# EAGLE board PushButton_RGB_w_Test (EAGLE 9.6.2)
RELEASE_DATE: 09.01.2023
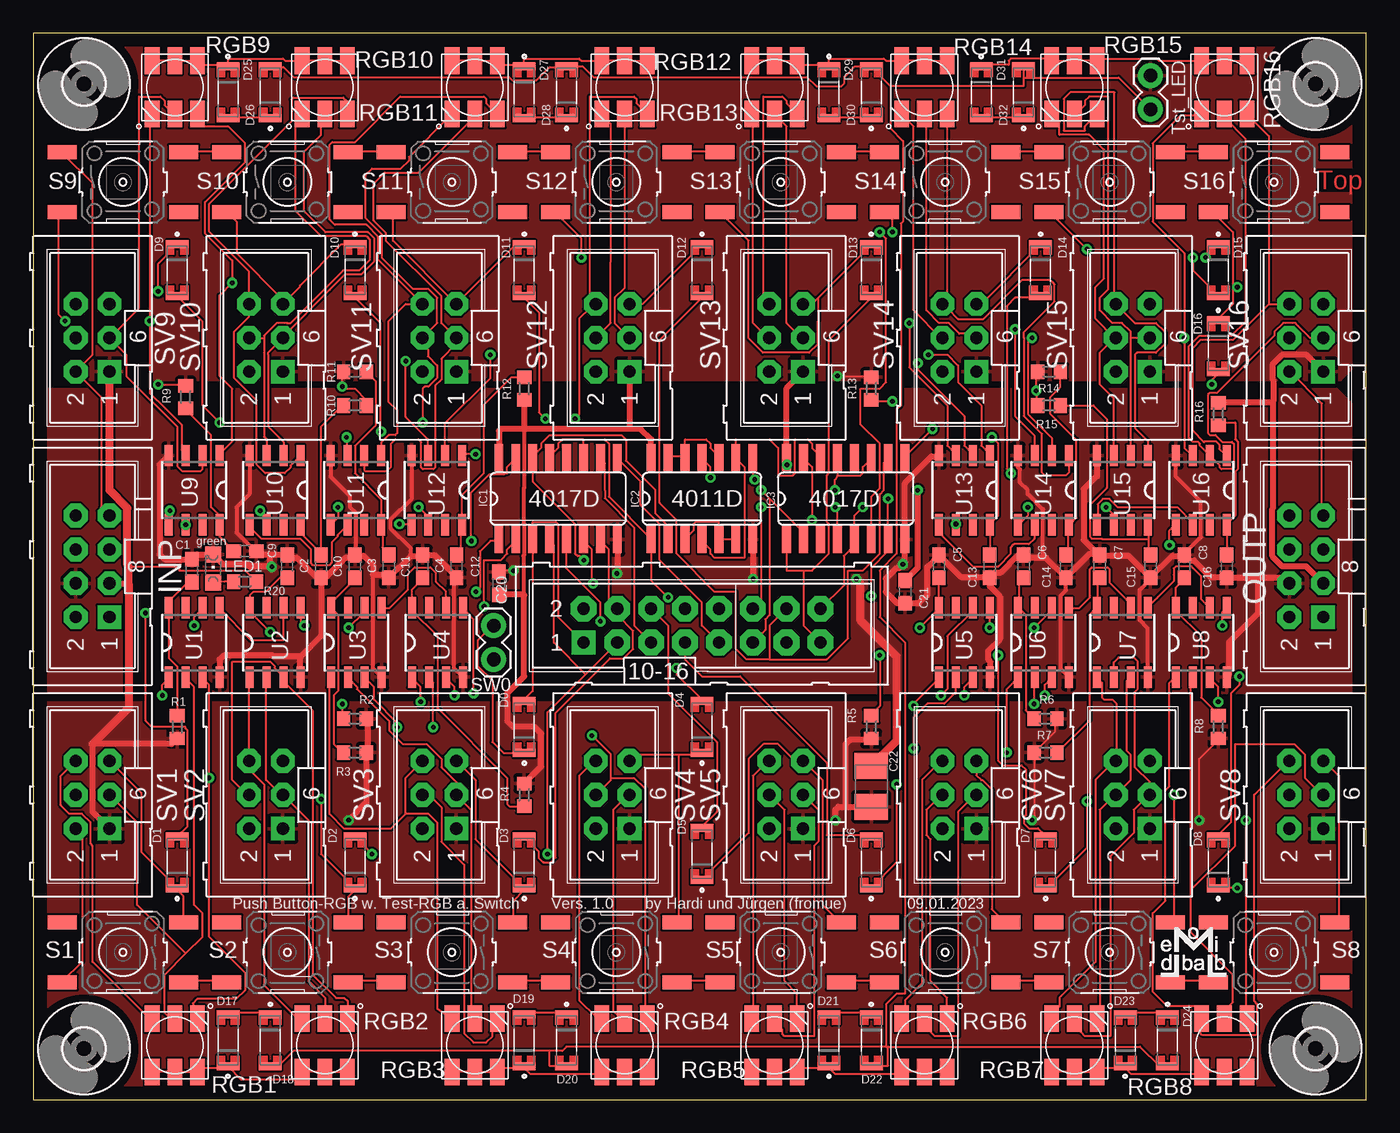
[diagram p1: board, top side]
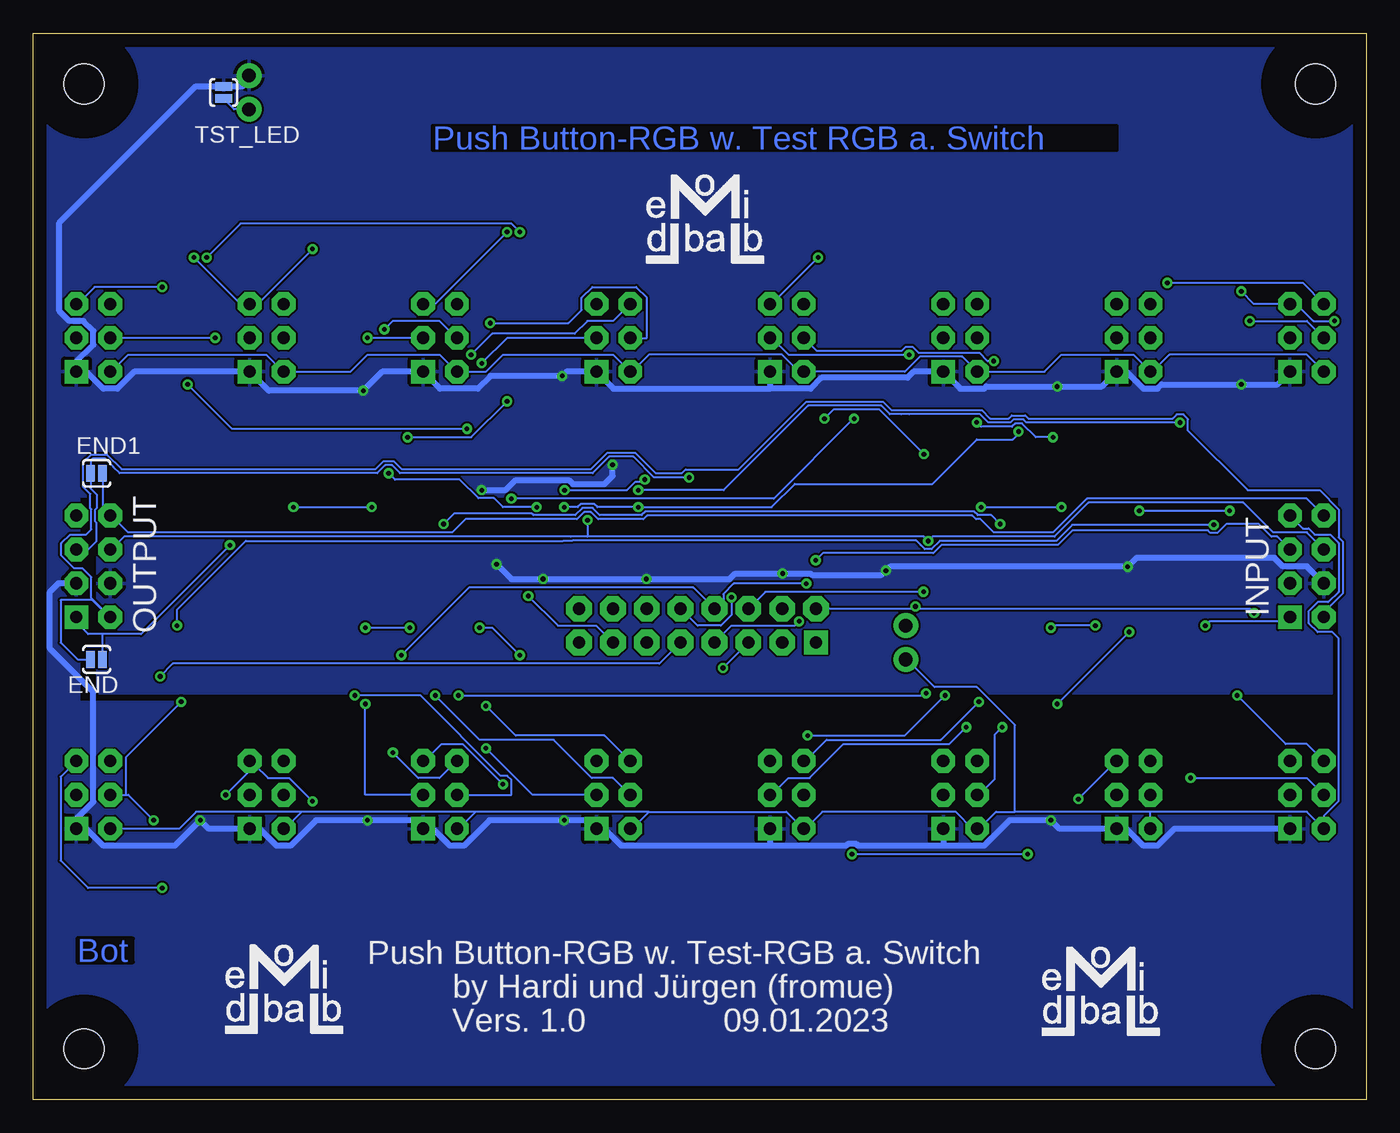
[diagram p2: board, bottom side, seen from below]

Size 100 x 80 mm. Coordinates in mm from the lower left corner, seen from the top.
Outline: 0,0 100,0 100,80 0,80 0,0
Copper layers (1*16): Top 0.035mm / dielectric 1.5mm / Bottom 0.035mm
Design rules "default *": minimum track width 6mil, minimum drill 0.35mm, track to track 6mil, track to pad 6mil, pad to pad 6mil, via to via 6mil, smd to smd 6mil, copper to edge 40mil, drill to drill 6mil, minimum pad ring 10mil, minimum via ring 8mil, stop-mask expansion 4mil, vias tented up to drill 0.35mm, thermal gap 10mil

## Footprints (pad centres in the part's own frame; a part is rotated, then mirrored left to right if it is on the bottom)
CON-HARTING-ML_ML16 = drill 0.914 pad 1.778 square: 1 -8.89,-1.27 | drill 0.914 pad 1.93 octagon: 2 -8.89,1.27; 3 -6.35,-1.27; 4 -6.35,1.27; 5 -3.81,-1.27; 6 -3.81,1.27; 7 -1.27,-1.27; 8 -1.27,1.27; 9 1.27,-1.27; 10 1.27,1.27; 11 3.81,-1.27; 12 3.81,1.27; 13 6.35,-1.27; 14 6.35,1.27; 15 8.89,-1.27; 16 8.89,1.27
C0603 = smd 1.1 x 1: 1 -0.85,0; 2 0.85,0
B/3528-21R = smd 1.95 x 2.5: + 1.525,0; - -1.525,0
DIO_LL4148 = smd 0.6 x 1.65: A 1.95,0; C -1.95,0
SJ_2S-NO = smd 0.635 x 1.27: 1 -0.45,0; 2 0.45,0
3,0 = hole 3: 0,0
SO16 = smd 0.66 x 2.032: 1 -4.445,-3.073; 2 -3.175,-3.073; 3 -1.905,-3.073; 4 -0.635,-3.073; 5 0.635,-3.073; 6 1.905,-3.073; 7 3.175,-3.073; 8 4.445,-3.073; 9 4.445,3.073; 10 3.175,3.073; 11 1.905,3.073; 12 0.635,3.073; 13 -0.635,3.073; 14 -1.905,3.073; 15 -3.175,3.073; 16 -4.445,3.073
SO14 = smd 0.66 x 2.032: 1 -3.81,-3.073; 2 -2.54,-3.073; 3 -1.27,-3.073; 4 0,-3.073; 5 1.27,-3.073; 6 2.54,-3.073; 7 3.81,-3.073; 8 3.81,3.073; 9 2.54,3.073; 10 1.27,3.073; 11 0,3.073; 12 -1.27,3.073; 13 -2.54,3.073; 14 -3.81,3.073
CON-HARTING-ML_ML08 = drill 0.914 pad 1.778 square: 1 -5.08,-1.27 | drill 0.914 pad 1.778 octagon: 2 -5.08,1.27; 3 -2.54,-1.27; 4 -2.54,1.27; 5 0,-1.27; 6 0,1.27; 7 2.54,-1.27; 8 2.54,1.27
CHIPLED_0805 = smd 1.2 x 1.2: A 0,-1.05; C 0,1.05
R0603 = smd 1 x 1.1: 1 -0.85,0; 2 0.85,0
RGBLED5050 = smd 2 x 1.1: 1 -2,1.7; 2 -2,0; 3 -2,-1.7; 4 2,-1.7; 5 2,0; 6 2,1.7
B3F-10XX_SMD = smd 2.184 x 1.067: 1 -4.55,2.25; 2 4.55,2.25; 3 -4.55,-2.25; 4 4.55,-2.25
CON-HARTING-ML_ML6 = drill 0.914 pad 1.778 square: 1 -2.54,-1.27 | drill 0.914 pad 1.778 octagon: 2 -2.54,1.27; 3 0,-1.27; 4 0,1.27; 5 2.54,-1.27; 6 2.54,1.27
1X02 = drill 1.016 pad 1.88: 1 0,0; 2 2.54,0
SOP8 = smd 0.6 x 1.6: 1 -1.905,-2.6; 2 -0.635,-2.6; 3 0.635,-2.6; 4 1.905,-2.6; 5 1.905,2.6; 6 0.635,2.6; 7 -0.635,2.6; 8 -1.905,2.6

## Placement (x,y rotation side)
BUT10_16  [CON-HARTING-ML_ML16]  50.16,35.56 0 top
C1  100n  [C0603]  11.91,39.69 90 top
C2  100n  [C0603]  19.05,40.01 90 top
C3  100n  [C0603]  24.13,40.01 90 top
C4  100n  [C0603]  29.21,40.01 90 top
C5  100n  [C0603]  67.94,40.01 90 top
C6  100n  [C0603]  74.3,40.01 90 top
C7  100n  [C0603]  80.01,40.01 90 top
C8  100n  [C0603]  86.36,40.01 90 top
C9  100n  [C0603]  15.88,41.15 0 top
C10  100n  [C0603]  21.59,40.01 270 top
C11  100n  [C0603]  26.67,40.01 270 top
C12  100n  [C0603]  31.75,40.01 270 top
C13  100n  [C0603]  71.75,40.01 270 top
C14  100n  [C0603]  77.47,40.01 270 top
C15  100n  [C0603]  83.82,40.01 270 top
C16  100n  [C0603]  89.53,40.01 270 top
C20  100n  [C0603]  34.92,38.73 90 top
C21  100n  [C0603]  65.41,38.1 270 top
C22  100uF  [B/3528-21R]  62.87,23.5 270 top
D0  LL4148  [DIO_LL4148]  36.83,27.94 90 top
D1  LL4148  [DIO_LL4148]  10.79,17.78 90 top
D2  LL4148  [DIO_LL4148]  24.13,17.78 90 top
D3  LL4148  [DIO_LL4148]  36.83,17.78 90 top
D4  LL4148  [DIO_LL4148]  50.16,27.94 90 top
D5  LL4148  [DIO_LL4148]  50.16,18.41 90 top
D6  LL4148  [DIO_LL4148]  62.87,17.78 90 top
D7  LL4148  [DIO_LL4148]  75.95,17.78 90 top
D8  LL4148  [DIO_LL4148]  88.9,17.78 90 top
D9  LL4148  [DIO_LL4148]  10.79,62.23 270 top
D10  LL4148  [DIO_LL4148]  24.13,62.23 270 top
D11  LL4148  [DIO_LL4148]  36.83,62.23 270 top
D12  LL4148  [DIO_LL4148]  50.16,62.23 270 top
D13  LL4148  [DIO_LL4148]  62.87,62.23 270 top
D14  LL4148  [DIO_LL4148]  75.56,62.23 270 top
D15  LL4148  [DIO_LL4148]  88.9,62.23 270 top
D16  LL4148  [DIO_LL4148]  88.9,56.52 270 top
D17  LL4148  [DIO_LL4148]  14.61,4.45 90 top
D18  LL4148  [DIO_LL4148]  17.78,4.45 270 top
D19  LL4148  [DIO_LL4148]  36.83,4.45 90 top
D20  LL4148  [DIO_LL4148]  40.01,4.45 270 top
D21  LL4148  [DIO_LL4148]  59.69,4.45 90 top
D22  LL4148  [DIO_LL4148]  62.87,4.45 270 top
D23  LL4148  [DIO_LL4148]  81.92,4.45 90 top
D24  LL4148  [DIO_LL4148]  85.09,4.45 270 top
D25  LL4148  [DIO_LL4148]  14.61,75.56 270 top
D26  LL4148  [DIO_LL4148]  17.78,75.56 90 top
D27  LL4148  [DIO_LL4148]  36.83,75.56 270 top
D28  LL4148  [DIO_LL4148]  40.01,75.56 90 top
D29  LL4148  [DIO_LL4148]  59.69,75.56 270 top
D30  LL4148  [DIO_LL4148]  62.87,75.56 90 top
D31  LL4148  [DIO_LL4148]  71.12,75.56 270 top
D32  LL4148  [DIO_LL4148]  74.3,75.56 90 top
END  SOLDERJUMPERNO  [SJ_2S-NO]  95.25,33.02 0 bottom
END1  SOLDERJUMPERNO  [SJ_2S-NO]  95.25,46.99 0 bottom
H1  MOUNT-HOLE3.0  [3,0]  96.19,3.81 0 top
H2  MOUNT-HOLE3.0  [3,0]  96.19,76.19 0 top
H3  MOUNT-HOLE3.0  [3,0]  3.81,76.19 0 top
H4  MOUNT-HOLE3.0  [3,0]  3.81,3.81 0 top
IC1  4017D  [SO16]  39.37,45.09 0 top
IC2  4011D  [SO14]  50.16,45.09 0 top
IC3  4017D  [SO16]  60.96,45.09 0 top
INP  [CON-HARTING-ML_ML08]  4.45,41.27 90 top
LED1  green  [CHIPLED_0805]  13.49,39.85 0 top
OUTP  [CON-HARTING-ML_ML08]  95.5,41.27 90 top
R1  470  [R0603]  10.79,27.94 270 top
R2  470  [R0603]  24.13,28.57 0 top
R3  470  [R0603]  24.13,26.04 0 top
R4  470  [R0603]  36.83,22.86 90 top
R5  470  [R0603]  62.87,27.94 270 top
R6  470  [R0603]  75.95,28.57 0 top
R7  470  [R0603]  75.95,26.04 180 top
R8  470  [R0603]  88.9,27.94 270 top
R9  470  [R0603]  11.43,52.7 90 top
R10  470  [R0603]  24.13,52.07 0 top
R11  470  [R0603]  24.13,54.61 180 top
R12  470  [R0603]  36.83,53.34 270 top
R13  470  [R0603]  62.87,53.34 90 top
R14  470  [R0603]  76.2,54.61 180 top
R15  470  [R0603]  76.2,52.07 180 top
R16  470  [R0603]  88.9,51.44 90 top
R20  470  [R0603]  15.88,38.86 0 top
RGB1  RGBLED5050  [RGBLED5050]  10.62,4.06 90 top
RGB2  RGBLED5050  [RGBLED5050]  21.86,4.06 90 top
RGB3  RGBLED5050  [RGBLED5050]  33.11,4.06 90 top
RGB4  RGBLED5050  [RGBLED5050]  44.36,4.06 90 top
RGB5  RGBLED5050  [RGBLED5050]  55.61,4.06 90 top
RGB6  RGBLED5050  [RGBLED5050]  66.86,4.06 90 top
RGB7  RGBLED5050  [RGBLED5050]  78.11,4.06 90 top
RGB8  RGBLED5050  [RGBLED5050]  89.36,4.06 90 top
RGB9  RGBLED5050  [RGBLED5050]  10.62,75.95 270 top
RGB10  RGBLED5050  [RGBLED5050]  21.86,75.95 270 top
RGB11  RGBLED5050  [RGBLED5050]  33.11,75.95 270 top
RGB12  RGBLED5050  [RGBLED5050]  44.36,75.95 270 top
RGB13  RGBLED5050  [RGBLED5050]  55.61,75.95 270 top
RGB14  RGBLED5050  [RGBLED5050]  66.86,75.95 270 top
RGB15  RGBLED5050  [RGBLED5050]  78.11,75.95 270 top
RGB16  RGBLED5050  [RGBLED5050]  89.36,75.95 270 top
S1  [B3F-10XX_SMD]  6.73,11.05 180 top
S2  [B3F-10XX_SMD]  19.07,11.05 180 top
S3  [B3F-10XX_SMD]  31.41,11.05 180 top
S4  [B3F-10XX_SMD]  43.74,11.05 180 top
S5  [B3F-10XX_SMD]  56.08,11.05 180 top
S6  [B3F-10XX_SMD]  68.42,11.05 180 top
S7  [B3F-10XX_SMD]  80.75,11.05 180 top
S8  [B3F-10XX_SMD]  93.09,11.05 180 top
S9  [B3F-10XX_SMD]  6.73,68.83 0 top
S10  [B3F-10XX_SMD]  19.07,68.83 0 top
S11  [B3F-10XX_SMD]  31.41,68.83 0 top
S12  [B3F-10XX_SMD]  43.74,68.83 0 top
S13  [B3F-10XX_SMD]  56.08,68.83 0 top
S14  [B3F-10XX_SMD]  68.42,68.83 0 top
S15  [B3F-10XX_SMD]  80.75,68.83 0 top
S16  [B3F-10XX_SMD]  93.09,68.83 0 top
SV1  [CON-HARTING-ML_ML6]  4.45,22.86 90 top
SV2  [CON-HARTING-ML_ML6]  17.45,22.86 90 top
SV3  [CON-HARTING-ML_ML6]  30.46,22.86 90 top
SV4  [CON-HARTING-ML_ML6]  43.47,22.86 90 top
SV5  [CON-HARTING-ML_ML6]  56.48,22.86 90 top
SV6  [CON-HARTING-ML_ML6]  69.48,22.86 90 top
SV7  [CON-HARTING-ML_ML6]  82.49,22.86 90 top
SV8  [CON-HARTING-ML_ML6]  95.5,22.86 90 top
SV9  [CON-HARTING-ML_ML6]  4.45,57.15 90 top
SV10  [CON-HARTING-ML_ML6]  17.45,57.15 90 top
SV11  [CON-HARTING-ML_ML6]  30.46,57.15 90 top
SV12  [CON-HARTING-ML_ML6]  43.47,57.15 90 top
SV13  [CON-HARTING-ML_ML6]  56.48,57.15 90 top
SV14  [CON-HARTING-ML_ML6]  69.48,57.15 90 top
SV15  [CON-HARTING-ML_ML6]  82.49,57.15 90 top
SV16  [CON-HARTING-ML_ML6]  95.5,57.15 90 top
SW0  [1X02]  34.54,33.02 90 top
TST_LED  SOLDERJUMPERNO  [SJ_2S-NO]  85.72,75.56 270 bottom
TST_LED1  Tst_LED  [1X02]  83.82,74.3 90 top
U1  [SOP8]  12.06,34.29 0 top
U2  [SOP8]  18.15,34.29 0 top
U3  [SOP8]  24.24,34.29 0 top
U4  [SOP8]  30.32,34.29 0 top
U5  [SOP8]  69.85,34.29 0 top
U6  [SOP8]  75.78,34.29 0 top
U7  [SOP8]  81.7,34.29 0 top
U8  [SOP8]  87.63,34.29 0 top
U9  [SOP8]  12.06,45.72 180 top
U10  [SOP8]  18.13,45.72 180 top
U11  [SOP8]  24.2,45.72 180 top
U12  [SOP8]  30.27,45.72 180 top
U13  [SOP8]  69.85,45.72 180 top
U14  [SOP8]  75.78,45.72 180 top
U15  [SOP8]  81.7,45.72 180 top
U16  [SOP8]  87.63,45.72 180 top

## Tracks (layer width: path | path; a pad name or v marks a point on that pad's centre or on a via)
+5V  (via drill 0.35)
  Top 0.152: R6.2 76.68,28.57 76.68,27.61 R7.2 75.1,20.96 75.09,20.95 v74.93,20.95 | v87.47,20.95 87.47,25.56 88.9,26.99 R8.2 | 25.08,26.04 R3.2 | 7.14,40.01 10.79,40.01 10.95,39.85 10.95,39.69 15.88,39.69 16.67,38.89 R20.2 | v9.37,53.66 11.43,53.66 R9.2 | R11.2 23.34,54.61 23.18,54.45 v23.18,53.5 23.34,53.34 24.13,53.34 24.98,52.49 R10.2 | v60.33,54.29 62.87,54.29 R13.2 | R15.2 75.25,52.07 v75.25,53.18 75.25,54.51 R14.2
  Top 0.305: 36.83,50.32 36.83,45.89 36.78,45.84 36.78,43.2 36.83,43.15 36.83,40.87 36.77,40.81 36.77,37.88
  Top 0.457: IC1.16 34.92,50.16 35.08,50.32 36.83,50.32 | IC2.14 46.35,49.54 45.57,50.32 44.77,50.32 | R12.2 36.83,50.32 | R2.2 25.08,28.47 25.08,26.04 | R3.2 24.98,22.28 v23.65,20.95 | R4.2 38.1,24.98 38.1,27.46 37.62,27.94 36.04,27.94 35.56,28.42 35.56,30.48 36.83,31.75 36.83,37.83 36.77,37.88 C20.1 | v60.17,20.95 60.17,21.75 60.39,21.97 60.96,21.97 | 60.96,21.97 C22.+ | 60.96,21.97 60.96,26.67 61.28,26.99 62.76,26.99 R5.2 | C21.1 66.36,39.9 v66.36,45.72 | SV13.1 56.52,53.38 IC3.16 56.54,48.13 v56.54,47.62 | INP.3 7.14,38.73 | SV1.1 4.45,21.59 4.45,26.67 10.38,26.67 R1.2 | 93.03,52.39 93.03,44.41 92.96,44.34 92.96,40.75 93.7,40.01 95.5,40.01 OUTP.3 | 93.03,52.39 92.92,52.28 R16.2 | SV16.1 95.5,55.88 93.7,55.88 92.96,55.14 92.96,54.08 93.03,54.02 93.03,52.39 | 44.77,50.32 36.83,50.32 | 44.77,50.32 44.74,50.35 SV12.1
  Top 0.61: 4.45,26.67 7.14,29.37 7.14,38.73 7.14,40.01 7.06,40.09 7.06,44.37 5.71,45.72 SV9.1
  Bottom 0.152: 83.66,20.32 SV7.1 | 96.68,20.32 SV8.1
  Bottom 0.457: SV1.1 14.39,20.32 15.66,19.05 16.71,19.05 17.98,20.32 SV2.1 23.02,20.32 v23.65,20.95 26.76,20.95 28.66,19.05 31.73,19.05 | 31.73,19.05 38.14,19.05 38.26,19.17 38.89,19.17 39.02,19.05 44.61,19.05 | SV3.1 31.73,19.05 | 44.61,19.05 55.88,19.05 57.15,20.32 SV5.1 58.38,20.95 v60.17,20.95 65.78,20.95 67.69,19.05 68.74,19.05 70.01,20.32 SV6.1 71.39,20.95 v74.93,20.95 78.79,20.95 80.7,19.05 81.75,19.05 83.02,20.32 83.66,20.32 | SV4.1 44.74,19.18 44.61,19.05 | v66.36,45.72 64.57,45.72 63.81,46.48 59.82,46.48 59.52,46.18 57.15,46.18 56.54,46.78 v56.54,47.62 | 44.77,53.34 56.48,53.34 SV13.1 60.01,54.61 v60.33,54.29 65.71,54.29 66.66,53.34 69.48,53.34 SV14.1 73.82,54.61 v75.25,53.18 82.33,53.18 SV15.1 92.43,54.61 93.7,53.34 94.76,53.34 96.03,54.61 SV16.1 96.77,55.35 95.5,56.62 95.5,57.68 96.24,58.42 97.3,58.42 98.04,59.16 98.04,65.79 87.81,76.02 TST_LED.1 84.32,76.02 83.82,76.52 TST_LED1.2 | SV9.1 6.67,53.66 v9.37,53.66 15.34,53.66 15.66,53.34 16.71,53.34 17.98,54.61 SV10.1 19.83,53.5 v23.18,53.5 28.51,53.5 28.66,53.34 30.46,53.34 SV11.1 33.96,54.61 34.42,54.15 40.86,54.15 41.67,53.34 44.77,53.34 | 44.77,53.34 | SV12.1 44.74,53.37 44.77,53.34 | SV7.1 86.84,20.32 v87.47,20.95 89.38,19.05 94.76,19.05 96.03,20.32 96.68,20.32 | SV8.1 96.77,21.06 95.5,22.33 95.5,30.57 98.75,33.83 98.75,38.1 98.12,38.73 OUTP.3
  pour Top: 0.16,53.98 98.11,53.98 100.01,55.88 100.01,79.06 99.06,80.01 2.54,80.01 0,77.47 0,54.13
  pour Top: 99.06,29.84 99.38,29.84 100.01,29.21 100.01,0.95 99.06,0 1.27,0 0,1.27 0,2.54 0,29.21 0.64,29.84 3.81,29.84
  pour Bottom: 0,29.84 99.69,29.84 101.6,27.94 101.6,1.27 100.33,0 91.44,0 0,0 -1.27,1.27 -1.27,29.21 -0.64,29.84
  pour Bottom: 0,45.24 98.58,45.24 100.33,46.99 100.33,78.74 99.06,80.01 2.54,80.01 0,77.47
  pour Bottom: 95.89,45.24 95.89,45.09 95.73,45.24 2.06,45.24 2.06,30 2.22,29.84 96.52,29.84 96.52,45.09 100.33,45.09 100.33,2.54 97.79,0 1.27,0 0,1.27 0,77.47 2.54,80.01 99.06,80.01 100.33,78.74 100.33,45.72 99.85,45.24
BUTTONS
  Top 0.152: SV1.2 3.65,19.84 3.65,10.32 2.22,8.89 S1.2 | S9.1 2.22,70.96 4.45,68.74 4.45,55.88 SV9.2 5.08,52.7 5.08,44.45 INP.7 | SV16.2 94.3,54.61 96.68,52.23 96.68,43.81 OUTP.7
  Bottom 0.152: 53.82,21.59 43.5,21.59 42.23,20.32 SV4.2 42.07,20.32 40.8,21.59 30.8,21.59 29.53,20.32 SV3.2 29.05,20.32 27.78,21.59 26.35,21.59 | 53.82,21.59 55.09,20.32 SV5.2 | 66.83,21.59 68.1,20.32 SV6.2 | 53.82,21.59 66.83,21.59 | 79.85,21.59 81.12,20.32 SV7.2 | 66.83,21.59 79.85,21.59 | SV8.2 89.06,20.32 87.79,21.59 79.85,21.59 | 26.35,21.59 26.35,28.1 29.21,30.96 32.38,30.96 34.45,33.02 SW0.1 | SV9.2 4.45,55.88 14.76,55.88 16.03,54.61 SV10.2 16.19,54.61 17.46,55.88 22.86,55.88 24.13,54.61 SV11.2 30.31,55.73 33.49,55.73 34.61,54.61 SV12.2 42.55,54.61 43.81,55.88 53.82,55.88 55.09,54.61 SV13.2 55.24,54.61 56.52,55.88 64.77,55.88 66.04,54.61 SV14.2 68.26,54.61 69.53,55.88 74.93,55.88 76.2,54.61 SV15.2 81.28,54.61 82.55,55.88 92.87,55.88 94.14,54.61 SV16.2 | INP.7 4.75,42.85 4.32,42.85 3.86,42.39 2.71,42.39 2.06,41.74 2.06,38.1 2.85,37.31 3.64,37.31 4.29,36.66 4.29,35.73 3.64,35.08 2.53,35.08 2.06,34.6 2.06,22.4 3.17,21.28 SV1.2 4.45,21.59 16.18,21.59 | SV2.2 16.18,21.59 | 16.18,21.59 26.35,21.59
CLK_IN  (via drill 0.35)
  Top 0.152: IC2.2 47.62,43.02 46.67,43.97 46.67,45.72 44.45,47.94 44.45,49.53 44.13,49.85 38.73,49.85 38.1,49.21 38.1,48.9 37.47,48.26 IC1.14 37.47,46.35 40.64,43.18 40.64,40.98 40.85,40.77 41,40.77 v41.3,40.47
  Bottom 0.152: v41.3,40.47 40.77,41 32.48,41 31.86,41.62 23.13,41.62 22.04,42.7 11.87,42.7 11.68,42.51 11.18,42.51 10.51,43.18 8.05,43.18 7.11,42.24 6.68,42.24 INP.5
CLK_NEXT_CHAIN
  Bottom 0.152: END1.2 94.77,46.99 94.77,43.81 OUTP.8 94.14,43.81 92.87,42.55 68.58,42.55 67.59,43.54 59.21,43.54 58.67,44.08 58.17,44.08 57.63,43.54 54.23,43.54 53.96,43.81 29.55,43.81 29.27,43.54 28.93,43.54 27.94,42.55 23.5,42.55 20.95,45.09 4.45,45.09 INP.8
CLK_OUT  (via drill 0.35)
  Top 0.152: v50.8,46.67 50.8,47.47 50.16,48.1 IC2.11
  Bottom 0.152: v50.8,46.67 53.42,46.67 54.98,48.23 56.8,48.23 58.04,46.99 72.48,46.99 73.09,47.6 73.59,47.6 74.2,46.99 93.52,46.99 93.99,47.46 93.99,47.48 94.61,48.1 95.54,48.1 95.7,47.94 END1.1 95.7,45.85 95.25,45.4 95.25,44.38 95.35,44.28 95.35,43.35 95.25,43.25 95.25,41.91 95.89,41.27 OUTP.5
DIN  (via drill 0.35)
  Top 0.152: v12.06,35.56 12.06,36.2 12.7,36.83 U1.6
  Bottom 0.152: v12.06,35.56 11.75,35.88 6.03,35.88 INP.1
GND  (via drill 0.35)
  Top 0.152: 71.75,39.21 C13.2 | 80.01,40.96 C7.2 80.01,40.8 | 77.47,39.05 C14.2 | 89.53,39.21 C16.2 | 86.36,40.8 C8.2 | 83.82,39.05 C15.2 | 94.14,38.73 OUTP.4 | 29.21,40.8 C4.2 | 20,33.02 20,33.18 | 21.59,39.21 C10.2 | v36.04,39.69 34.92,39.69 C20.2 | 16.67,41.12 C9.2
  Top 0.305: 77.47,39.05 77.47,38.21 77.08,37.82 77.08,32.3 U6.4 | U7.4 83.61,35.36 83,35.96 83,38.24 83.82,39.05 | 75.98,40.64 75.75,40.88 75.75,44.28 74.61,45.42 74.61,45.72 74.03,46.31 74.03,47.27 73.87,47.43 U14.4 | C8.2 86.36,40.95 87.6,42.19 87.6,44.86 85.72,46.73 U16.4 | U4.4 31.56,32.35 31.56,38.97 C12.2 | U3.4 25.48,32.35 25.48,39.37 | 28.31,40.8 28.31,41.36 26.78,42.9 26.78,43.46 28.36,45.05 U12.4 | U11.4 22.3,46.76 23.75,45.31 23.75,44.47 24.17,44.05 24.17,41.16 24.13,41.12 C3.2 | U10.4 16.23,45.44 15.24,44.45 15.24,42.55 16.67,41.12
  Top 0.457: 71.75,39.21 69.59,39.21 C5.2 67.06,39.97 67.06,37.85 66.46,37.25 C21.2 64.81,37.25 63.96,38.1 63.96,39.09 64.75,39.88 64.96,39.88 v65.25,40.16 65.41,40.32 IC3.8 65.41,46.27 67.39,48.26 67.94,48.26 U13.4 | 80.01,40.96 79.27,40.96 C14.2 75.98,40.64 74.51,40.64 C6.2 73.89,40.85 72.58,39.55 72.15,39.55 C13.2 71.75,38.53 72.51,37.77 72.51,34.53 71.63,33.65 71.63,33.02 71.75,32.9 U5.4 | 86.36,40.8 85.46,40.8 C15.2 82.18,40.8 80.01,40.8 78.81,42 78.81,45.79 79.8,46.78 U15.4 | C8.2 86.75,40.46 87.07,40.46 88.32,39.21 89.53,39.21 | C16.2 91.92,39.16 | 91.92,39.16 93.72,39.16 94.14,38.73 | U8.4 89.73,31.88 89.73,34.33 91.92,36.51 91.92,39.16 | IC1.8 43.81,39.49 v43.79,39.47 | IC2.7 54,41.98 v54,39.05 | C12.2 31.69,39.21 31.69,39.27 30.11,40.85 C4.2 | U9.4 9.48,47.64 9.48,40.9 9.84,40.54 C1.2 12.27,40.9 LED1.C 14.24,40.15 16.06,40.15 16.23,39.98 v17.89,39.98 17.78,40.09 17.78,40.85 | 29.21,40.8 28.31,40.8 C11.2 26.45,39.37 25.48,39.37 25.48,40.09 24.77,40.8 24.19,40.8 C3.2 23.91,40.64 23.39,40.64 21.97,39.21 21.59,39.21 21.21,39.21 19.79,40.64 19.27,40.64 C2.2 17.78,40.85 | 17.78,40.85 17.02,40.85 C9.2 | C10.2 21.59,34.77 20.08,33.26 | 20.08,33.26 20,33.18 | U2.4 20,31.74 20,33.02 | 20.08,33.26 18.03,33.26 17.97,33.32 14.27,33.32 13.97,33.02 U1.4
  Top 0.61: C22.- 64.77,26.93 64.77,33.25 62.03,35.99 62.03,38.78 v61.75,39.05
  Bottom 0.457: INP.4 4.45,40.01 6.24,40.01 6.88,40.64 17.23,40.64 v17.89,39.98 35.75,39.98 v36.04,39.69 36.35,39.37 41.59,39.37 41.69,39.47 v43.79,39.47 47.34,39.47 47.75,39.05 v54,39.05 v61.75,39.05 64.14,39.05 v65.25,40.16
  pour Top: 0,53.34 97.79,53.34 100.33,50.8 100.33,31.75 99.06,30.48 1.27,30.48 0,31.75
  pour Bottom: 2.54,44.45 95.25,44.45 95.25,30.48 2.54,30.48
N$1
  Top 0.152: 51.44,42.07 51.44,43.34 49.69,43.34 49.53,43.18 49.53,42.7 48.9,42.07 IC2.3 | 51.44,42.07 52.7,42.07 IC2.6 | 51.44,42.07 IC2.5
N$2
  Top 0.152: U11.6 23.5,43.02 22.82,42.35 22.82,42.23 22.38,41.78 22.38,40.27 22.18,40.08 21,40.08 20.8,40.27 20.8,41.32 20.02,42.09 17.1,42.09 16.34,42.86 16.34,43.01 U10.5
N$3  (via drill 0.35)
  Top 0.152: 55.24,45.09 57.78,42.55 IC3.2 | 55.24,45.09 v54.61,45.72 | BUT10_16.11 54.93,35.24 54.93,36.04 55.24,36.35 55.24,45.09 | D9.A 12.7,58.38 12.7,52.07 v13.97,50.8
  Bottom 0.152: v54.61,45.72 48.22,45.72 43.16,50.78 41.88,52.06 36.39,52.06 35.74,51.41 34.9,51.41 34.29,51.41 28.96,51.41 28.35,50.8 26.69,50.8 26.46,51.03 25.7,51.03 25.48,50.8 v13.97,50.8
N$4
  Top 0.152: U1.5 13.97,36.83 16.35,34.45 18.73,34.45 18.73,36.83 U2.6
N$5  (via drill 0.35)
  Top 0.152: 41.27,49.53 39.69,49.53 39.37,49.21 39.37,48.9 38.73,48.26 IC1.13 | IC1.11 41.27,49.53 | 41.27,49.53 42.86,49.53 43.18,49.21 43.18,45.24 46.35,42.07 IC2.1 46.35,38.95 v47.62,37.67
  Bottom 0.152: BUT10_16.10 50.16,35.56 48.42,35.56 47.62,36.35 v47.62,37.67
N$6  (via drill 0.35)
  Top 0.152: v23.18,29.69 23.18,28.57 R2.1 | v17.78,35.08 16.35,36.51 16.35,36.83 U2.8 16.25,37.82 16.51,38.08 17.44,38.08 18.51,39.16 C2.1
  Bottom 0.152: v17.78,35.08 v23.18,29.69
N$7
  Top 0.152: SW0.2 34.45,35.56 33.34,34.45 33.34,32.54 34.45,31.43 34.45,26.83 35.29,25.99 D0.C
N$8
  Top 0.152: SV2.4 16.03,22.86 14.92,23.97 14.92,32.86 17.78,32.86 18.1,32.54 18.1,32.38 18.73,31.75 U2.3 18.89,31.59 18.89,31.27 20.95,29.21 20.95,9.37 22.7,7.62 23.34,7.62 23.57,7.39 RGB2.4
N$9
  Top 0.152: 16.19,25.4 16.19,31.59 U2.1 | 16.19,25.4 16.19,24.77 17.3,23.65 17.3,8.57 19.68,6.19 RGB2.6 | 16.19,25.4 SV2.6
N$10
  Top 0.152: U2.2 17.46,31.59 17.46,23.97 18.57,22.86 SV2.3 18.73,22.86 20.64,20.95 20.64,8.89 21.91,7.62 21.91,6.11 RGB2.5
N$11  (via drill 0.35)
  Top 0.152: v33.81,36.99 33.81,40.48 35.08,40.48 35.56,40.96 35.56,41.27 36.2,41.91 IC1.2 | v8.41,36.51 8.41,28.42 8.89,27.94 11.43,27.94 11.43,27.83 11.57,27.68 11.57,20.51 D1.A
  Bottom 0.152: v8.41,36.51 8.73,36.83 33.81,36.83 | BUT10_16.2 33.81,36.83 | 33.81,36.83 v33.81,36.99
N$12  (via drill 0.35)
  Top 0.152: v25.4,18.41 24.13,19.68 D2.A | BUT10_16.3 41.43,31.91 | 41.43,31.91 39.05,34.29 39.05,41.59 38.73,41.91 IC1.4 | v38.58,18.41 38.58,29.05 41.43,31.91
  Bottom 0.152: v38.58,18.41 v25.4,18.41
N$13
  Top 0.152: D3.A 36.83,19.68 37.94,18.57 37.94,18.1 38.26,17.78 38.29,17.81 38.83,17.81 39.18,18.16 39.18,29.02 43.26,33.1 44.31,33.1 44.37,33.1 44.37,33.16 45.01,33.8 45.01,35.16 43.81,36.35 BUT10_16.4 43.18,37.47 43.18,41.27 42.55,41.91 IC1.7
N$14  (via drill 0.35)
  Top 0.152: v48.26,32.38 48.26,31.91 50.16,30 D4.A | BUT10_16.5 45.09,35.56 45.09,36.83 | IC1.10 42.55,48.1 42.86,47.78 42.86,45.72 42.88,45.71 42.88,45.12 45.09,42.91 45.09,36.83 | 45.09,36.83
  Bottom 0.152: BUT10_16.5 v48.26,32.38
N$15  (via drill 0.35)
  Top 0.152: BUT10_16.6 47.62,35.56 47.62,30.48 51.28,26.83 51.28,21.59 50.16,20.48 D5.A | IC1.1 34.92,41.91 34.29,41.91 33.51,41.13 33.51,38.4 v33.21,38.1
  Bottom 0.152: BUT10_16.6 45.09,38.1 v33.21,38.1
N$16  (via drill 0.35)
  Top 0.152: BUT10_16.7 48.9,33.02 50.16,31.75 53.02,31.75 59.53,25.24 59.53,19.84 62.87,19.84 D6.A | v42.55,35.88 42.55,37.31 40.01,39.85 IC1.5
  Bottom 0.152: v42.55,35.88 42.86,35.56 47.62,35.56 BUT10_16.7
N$17  (via drill 0.35)
  Top 0.152: v72.39,33.34 72.39,33.02 72.42,32.99 72.42,25.4 72.74,25.08 74.14,25.08 74.45,24.77 74.45,21.34 74.32,21.21 74.32,20.7 74.68,20.35 75.38,20.35 75.88,19.84 D7.A | IC1.6 41.27,41.91 41.91,41.27 41.91,38.8 v42,38.71
  Bottom 0.152: v72.39,33.34 67.31,38.42 50.48,38.42 BUT10_16.8 48.23,37.49 48.23,37.93 47.45,38.71 v42,38.71
N$18  (via drill 0.35)
  Top 0.152: v90.49,31.75 90.49,31.11 89.85,30.48 89.85,20.8 88.9,19.84 D8.A | BUT10_16.9 50.16,35.56 50.16,37.31 46.99,40.48 46.99,43.18 45.56,44.61 45.56,46.35 43.81,48.1 IC1.9
  Bottom 0.152: v90.49,31.75 89.53,32.7 53.02,32.7 BUT10_16.9
N$19
  Top 0.152: 11.43,10.95 9.84,9.37 9.84,6.51 10.16,6.19 RGB1.5 | 11.43,10.95 12.7,12.22 12.7,13.97 12.06,14.61 12.06,30.96 11.43,31.59 U1.2 | SV1.3 7.78,20.8 7.78,14.61 11.43,10.95
N$20
  Top 0.152: 63.98,3.97 40.01,3.97 39.69,3.65 38.73,3.65 | 63.98,3.97 64.14,3.97 | 64.14,3.97 83.03,3.97 84.5,2.5 D24.A | D26.A 17.78,77.47 18.77,77.47 19.52,76.72 35.68,76.72 35.91,76.49 37.75,76.49 38.73,77.47 40.01,77.47 D28.A 41.22,77.52 42.02,76.72 58.06,76.72 58.74,76.04 60.64,76.04 60.84,76.24 60.84,76.72 61.64,77.52 D30.A 62.87,77.47 64.29,76.04 | 64.29,76.04 74.3,76.04 74.3,76.68 | D32.A 74.3,76.68 | TST_LED1.1 81.44,76.68 74.3,76.68 | 63.98,3.97 63.98,7.14 64.77,7.94 65.41,7.94 65.41,34.29 63.5,36.2 63.5,39.69 64.77,40.96 64.77,51.75 65.09,52.07 65.09,65.72 65.25,65.88 65.25,71.91 64.29,72.87 64.29,76.04 | D18.A 17.19,2.54 18.41,2.54 19.53,3.65 38.73,3.65 | D22.A 62.91,2.54 64.14,2.54 64.14,3.97 | D20.A 38.78,2.5 38.73,2.54 38.73,3.65
  Bottom 0.152: TST_LED1.1 84.93,74.3 85.72,75.09 TST_LED.2
N$21
  Top 0.152: R20.1 14.35,38.86 LED1.A
N$22
  Top 0.152: D17.A 14.76,6.51 16.99,6.51 D18.C
N$23
  Top 0.152: S1.1 11.43,8.89 14.45,8.89 S2.2
N$24  (via drill 0.35)
  Top 0.152: v23.65,35.4 24.77,36.51 24.77,36.83 U3.6 | U2.5 20.05,35.67 20.16,35.56 v20.32,35.56
  Bottom 0.152: v20.32,35.56 23.5,35.56 v23.65,35.4
N$25
  Top 0.152: S10.3 14.61,66.52 15.24,65.88 15.24,63.5 18.72,60.02 SV10.5 20.02,60.98 20.02,61.09 23.11,64.18 D10.C
N$26  (via drill 0.35)
  Top 0.152: U1.3 12.7,31.59 13.18,31.11 v13.18,24.13 13.18,12.22 15.88,9.53 15.88,8.21 15.21,7.54 12.3,7.54 11.99,7.22 RGB1.4
  Bottom 0.152: SV1.4 4.45,24.13 v13.18,24.13
N$27  (via drill 0.35)
  Top 0.152: v9.68,30.32 9.68,31.11 10.16,31.59 U1.1 | RGB1.6 8.57,6.19 4.45,10.32 4.45,19.05 4.29,19.2 4.29,20.78 3.64,21.44 2.69,21.44 2.06,22.07 2.06,24.28 SV1.6
  Bottom 0.152: v9.68,30.32 6.03,26.67 4.45,26.67 SV1.6
N$28  (via drill 0.35)
  Top 0.152: v60.17,44.45 60.33,44.29 IC3.4 | D10.A 24.13,60.17 26.01,58.28 26.01,50.19 v26.08,50.12 | BUT10_16.12 54.61,37.47 v54.61,44.45
  Bottom 0.152: v26.08,50.12 26.04,50.07 26.04,50.01 26.51,49.53 29.21,49.53 32.54,46.2 42.86,46.2 44.61,44.45 v54.61,44.45 57.68,44.45 57.92,44.69 58.92,44.69 59.16,44.45 v60.17,44.45
N$29  (via drill 0.35)
  Top 0.152: v64.14,45.09 IC3.7 64.14,41.16 62.87,39.89 v62.87,37.78 | D11.A 36.83,60.17 37.94,59.05 37.94,51.56 v38.42,51.08
  Bottom 0.152: BUT10_16.13 57.78,35.56 60.64,35.56 v62.87,37.78 | v38.42,51.08 38.45,51.08 44.45,45.09 v64.14,45.09
N$30
  Top 0.152: 55.24,33.02 53.5,33.02 52.7,33.81 52.7,38.1 51.12,38.1 48.26,40.96 48.26,43.5 46.99,44.77 46.99,56.99 50.16,60.17 D12.A | 55.24,33.02 55.24,35.56 BUT10_16.14 | 55.24,33.02 59.53,33.02 61.12,34.61 61.12,39.69 62.23,39.69 63.5,40.96 63.5,45.4 63.82,45.72 63.82,47.78 64.14,48.1 IC3.10
N$31
  Top 0.152: 57.78,39.69 56.52,39.69 IC3.1 | 57.78,39.69 58.42,39.69 59.69,40.96 59.69,43.18 59.53,43.34 59.53,46.83 59.69,46.99 59.69,56.99 62.87,60.17 D13.A | BUT10_16.15 57.78,35.56 57.78,39.69
N$32
  Top 0.152: S2.1 23.65,8.89 26.83,8.89 S3.2
N$33  (via drill 0.35)
  Top 0.152: v73.34,46.99 73.03,47.31 73.03,59.53 73.66,60.17 75.56,60.17 D14.A | v62.23,44.45 61.59,43.81 IC3.5 61.59,41.59 60.8,40.8 60.8,38.58 BUT10_16.16
  Bottom 0.152: v62.23,44.45 64.77,44.45 65.43,45.11 66.61,45.11 68.01,46.51 72.87,46.51 v73.34,46.99
N$34
  Top 0.152: S3.1 36.04,8.89 39.05,8.89 S4.2
N$35
  Top 0.152: D0.A 36.83,30 37.47,30.64 IC1.3 37.47,43.34 39.21,43.34 39.37,43.18 39.37,36.2 BUT10_16.1
N$36  (via drill 0.35)
  Top 0.152: v87,63.18 87,62.23 88.9,60.33 D15.A | v63.5,65.09 63.98,64.61 63.98,53.82 63.5,53.34 62.07,53.34 62.07,50.64 63.5,49.21 63.5,45.88 62.87,45.24 IC3.6
  Bottom 0.152: v87,63.18 84.45,65.72 64.14,65.72 v63.5,65.09
N$37  (via drill 0.35)
  Top 0.152: v88.42,53.66 88.42,53.98 88.9,54.45 D16.A | v67.47,50.32 65.41,48.26 IC3.9
  Bottom 0.152: v88.42,53.66 85.09,50.32 v67.47,50.32
N$38
  Top 0.152: 48.9,48.26 47.62,48.26 IC2.13 | 48.9,48.26 48.9,49.53 50.48,49.53 50.8,49.21 50.8,48.9 51.44,48.26 IC2.10 | 48.9,48.26 IC2.12
N$39
  Top 0.152: D19.A 36.83,6.51 39.37,6.51 D20.C
N$40  (via drill 0.35)
  Top 0.152: IC3.13 60.33,46.83 | 60.33,46.83 62.07,46.83 62.23,46.99 62.23,47.47 62.87,48.1 IC3.11 | 60.33,46.83 60.17,46.51 60.14,46.49 v60.14,45.72 | IC2.8 53.98,46.67 v54.13,46.52
  Bottom 0.152: v60.14,45.72 55.47,45.72 54.86,46.33 54.32,46.33 v54.13,46.52
N$41
  Top 0.152: IC2.4 50.16,41.91 50.8,41.27 50.8,40.96 51.12,40.64 53.34,40.64 53.34,47.47 52.7,48.1 IC2.9 52.7,49.53 55.24,49.53 55.88,48.9 55.88,46.83 56.99,46.83 57.15,46.99 57.15,49.53 58.1,49.53 58.42,49.21 58.42,48.9 59.05,48.26 IC3.14
N$42
  Top 0.152: S4.1 48.42,8.89 51.44,8.89 S5.2
N$43
  Top 0.152: D21.A 59.69,6.51 62.23,6.51 D22.C
N$44
  Top 0.152: S5.1 60.64,8.89 63.82,8.89 S6.2
N$45
  Top 0.152: R3.1 23.18,26.04 22.54,26.67 22.54,30.32 22.86,30.64 22.86,36.35 22.38,36.83 U3.8 22.38,36.99 22.38,37.31 24.13,39.05 C3.1
N$46
  Top 0.152: S3.3 36.04,13.34 36.04,14.92 36.83,15.72 D3.C 36.83,15.88 33.18,19.53 33.18,23.97 31.75,25.4 SV3.5
N$47  (via drill 0.35)
  Top 0.152: v27.3,27.94 27.3,28.26 25.56,30 25.56,30.96 24.92,31.59 U3.3 | RGB3.4 34.45,6.03 34.45,4.76 33.97,4.29 33.02,4.29 32.34,4.97 32.34,17.61 30.61,19.34 30.61,21.93 29.69,22.86 SV3.4
  Bottom 0.152: SV3.4 29.05,22.86 27.86,24.05 27.86,27.38 v27.3,27.94
N$48
  Top 0.152: U3.1 22.23,31.59 22.23,21.43 23.34,20.32 26.82,20.32 27.94,21.44 | RGB3.6 30.31,6.84 30.31,20.78 29.65,21.44 27.94,21.44 | 27.94,21.44 27.94,24.15 SV3.6
N$49
  Top 0.152: U3.2 23.65,31.59 24.29,30.96 24.29,30.8 26.7,28.39 26.7,27.69 27.72,26.67 29.5,26.67 30.61,25.56 30.61,24.94 31.75,23.8 31.75,22.86 | 31.75,22.86 32.86,21.75 32.86,6.19 RGB3.5 | 31.75,22.86 SV3.3
N$50
  Top 0.152: RGB4.3 45.72,2.06 44.13,2.06 RGB4.2 43.97,2.06 42.39,2.06 RGB4.1 42.5,1.91 37.31,1.91 36.83,2.38 | 36.83,2.38 34.61,2.38 34.61,2.22 RGB3.3 34.45,2.06 32.86,2.06 RGB3.2 32.7,2.06 31.11,2.06 RGB3.1 | 36.83,2.38 D19.C
N$51
  Top 0.152: S6.1 73.03,8.89 76.2,8.89 S7.2
N$52
  Top 0.152: U3.5 26.73,36.89 28.11,38.27 28.11,39.43 28.61,39.93 29.8,39.93 30.21,39.52 30.21,38.84 30.96,38.1 U4.6
N$53
  Top 0.152: D23.A 81.92,6.51 85.09,6.51 D24.C
N$54
  Top 0.152: S7.1 85.41,8.89 88.42,8.89 S8.2
N$55
  Top 0.152: D25.A 14.61,73.66 17.78,73.66 D26.C
N$56
  Top 0.152: C4.1 29.21,39.05 28.42,38.26 28.42,36.99 U4.8 28.42,36.83 28.42,36.67 30.32,34.77 30.32,29.37 35.56,24.13 35.56,22.17 35.72,22.01 R4.1
N$57
  Top 0.152: S9.2 11.43,71.12 14.45,71.12 S10.1
N$58  (via drill 0.35)
  Top 0.152: v31.59,30.32 31.59,30.96 30.96,31.59 U4.3 | v41.91,27.3 43.34,25.88 43.34,24.13 | 43.34,24.13 43.34,23.97 42.23,22.86 SV4.4 | 43.34,24.13 45.09,24.13 45.88,23.34 45.88,6.19 RGB4.4
  Bottom 0.152: v31.59,30.32 34.61,27.3 v41.91,27.3
N$59  (via drill 0.35)
  Top 0.152: v29.05,29.84 29.05,30.96 28.42,31.59 U4.1 | RGB4.6 42.23,6.19 40.96,7.46 40.96,24.29 42.07,25.4 SV4.6
  Bottom 0.152: v29.05,29.84 31.91,26.99 40.48,26.99 42.07,25.4 SV4.6
N$60  (via drill 0.35)
  Top 0.152: v30,27.94 30,31.27 29.69,31.59 U4.2 | RGB4.5 43.97,6.19 43.5,6.67 43.5,21.75 44.61,22.86 SV4.3
  Bottom 0.152: v30,27.94 31.27,26.67 39.21,26.67 41.75,24.13 43.34,24.13 44.61,22.86 SV4.3
N$61
  Top 0.152: S10.2 23.65,71.12 26.83,71.12 S11.1
N$62
  Top 0.152: S11.2 36.04,71.12 39.05,71.12 S12.1
N$63  (via drill 0.35)
  Top 0.152: v33.02,30.48 33.02,36.04 32.23,36.83 U4.5 | v68.1,30.32 68.58,30.8 68.58,34.77 70.48,36.67 U5.6
  Bottom 0.152: v33.02,30.48 33.18,30.32 v68.1,30.32
N$64
  Top 0.152: D27.A 36.83,73.66 40.01,73.66 D28.C
N$65
  Top 0.152: S12.2 48.42,71.12 51.44,71.12 S13.1
N$66
  Top 0.152: D29.A 59.69,73.66 62.87,73.66 D30.C
N$67  (via drill 0.35)
  Top 0.152: v63.5,33.34 63.5,29.53 62.87,28.89 R5.1 | v66.52,35.4 67.94,36.83 U5.8 C5.1
  Bottom 0.152: v63.5,33.34 65.56,35.4 v66.52,35.4
N$68
  Top 0.152: S13.2 60.64,71.12 63.82,71.12 S14.1
N$69  (via drill 0.35)
  Top 0.152: v69.85,30.32 69.85,30.96 70.48,31.59 U5.3 | SV5.4 55.24,22.86 56.36,21.75 56.36,8.89 57.31,7.94 RGB5.4
  Bottom 0.152: v69.85,30.32 66.52,26.99 60.96,26.99 58.1,24.13 56.52,24.13 55.24,22.86 SV5.4
N$70  (via drill 0.35)
  Top 0.152: v66.04,29.53 66.04,29.69 67.94,31.59 U5.1 | RGB5.6 53.66,6.19 53.98,6.51 53.98,24.29 55.09,25.4 SV5.6
  Bottom 0.152: v66.04,29.53 63.82,27.3 57.15,27.3 55.24,25.4 SV5.6
N$71  (via drill 0.35)
  Top 0.152: U5.2 69.22,30.48 69.12,30.48 68.36,29.71 67.08,29.71 66.04,28.67 v66.04,26.35 | RGB5.5 55.4,6.03 56.2,5.24 56.2,4.92 56.36,4.76 58.58,4.76 58.58,19.05 58.9,19.37 58.9,21.75 57.78,22.86 SV5.3
  Bottom 0.152: v66.04,26.35 62.55,22.86 SV5.3
N$72
  Top 0.152: RGB6.3 68.1,2.06 66.67,2.06 RGB6.2 66.52,2.06 64.93,2.06 RGB6.1 65,1.91 60.17,1.91 59.69,2.38 | 59.69,2.38 56.99,2.38 56.99,2.22 RGB5.3 56.83,2.06 55.4,2.06 RGB5.2 55.24,2.06 53.66,2.06 RGB5.1 | 59.69,2.38 D21.C
N$73
  Top 0.152: S14.2 73.03,71.12 76.2,71.12 S15.1
N$74
  Top 0.152: D31.A 71.12,73.66 74.3,73.66 D32.C
N$75  (via drill 0.35)
  Top 0.152: v71.75,35.4 U5.5 | v75.09,35.4 76.36,36.67 76.36,36.83 U6.6
  Bottom 0.152: v75.09,35.4 v71.75,35.4
N$76
  Top 0.152: C1.1 11.63,38.84 10.16,37.37 U1.8 10.16,33.11 10.79,32.48 R1.1
N$77
  Top 0.152: S15.2 85.41,71.12 88.42,71.12 S16.1
N$80
  Top 0.152: R6.1 75.09,28.57 74.45,29.21 74.45,36.35 73.98,36.83 U6.8 73.98,36.99 73.98,38.73 74.3,39.05 C6.1
N$82  (via drill 0.35)
  Top 0.152: v75.88,30.32 75.88,31.11 76.36,31.59 U6.3 | SV6.4 68.1,22.86 66.99,21.75 66.99,19.84 67.31,19.53 67.31,8.89 68.56,7.64 RGB6.4
  Bottom 0.152: v75.88,30.32 70.96,30.32 64.93,24.29 64.45,24.29 64.14,23.97 64.14,22.86 SV6.4
N$83  (via drill 0.35)
  Top 0.152: v73.03,26.04 73.03,30.8 73.82,31.59 U6.1 | RGB6.6 64.93,6.19 65.41,6.67 65.41,7.46 66.67,8.73 66.67,23.97 68.1,25.4 SV6.6
  Bottom 0.152: v73.03,26.04 71.12,24.13 69.53,24.13 68.26,25.4 SV6.6
N$84  (via drill 0.35)
  Top 0.152: v75.09,29.69 75.09,31.59 U6.2 | RGB6.5 66.67,6.03 67.31,5.4 67.31,5.08 67.63,4.76 69.37,4.76 69.37,21.59 70.64,22.86 SV6.3
  Bottom 0.152: v75.09,29.69 75.09,22.86 SV6.3
N$87
  Top 0.152: U7.6 82.23,36.99 82.23,37.31 80.74,38.8 80.74,39.8 80.61,39.93 79.42,39.93 79.28,39.8 79.28,37.8 79.27,37.78 79.27,37.68 78.48,36.89 U6.5
N$91
  Top 0.152: R7.1 76.83,26.04 79.22,28.42 79.22,36.35 79.69,36.83 U7.8 79.85,36.99 79.85,38.89 80.01,39.05 C7.1
N$93
  Top 0.152: 21.59,40.96 20.16,42.39 20.16,43.02 U10.8 | 21.59,40.96 21.59,50.48 23.18,52.07 R10.1 | 21.59,40.96 C10.1
N$96
  Top 0.152: RGB7.4 79.53,6.19 80.01,6.67 80.01,21.75 81.12,22.86 SV7.4 82.34,23.98 82.34,25.86 82.04,26.16 82.04,31.39 U7.3
N$97
  Top 0.152: U7.1 79.85,31.59 80.17,31.27 80.17,30.16 80.33,30 80.96,30 81.28,29.69 81.28,25.46 SV7.6 81.12,25.4 79.69,23.97 79.69,10.32 76.99,7.62 76.99,6.99 76.2,6.19 RGB7.6
N$98
  Top 0.152: RGB7.5 77.79,6.03 78.58,5.24 78.58,5.08 78.9,4.76 80.8,4.76 80.8,18.26 82.55,20 82.55,21.75 83.66,22.86 SV7.3 83.76,23.82 82.64,24.94 82.64,30.57 82.87,30.8 82.87,32.86 82.55,33.18 81.44,33.18 81.07,32.81 U7.2
N$99
  Top 0.152: RGB8.3 90.65,2.06 89.06,2.06 RGB8.2 88.9,2.06 87.47,2.06 RGB8.1 87.5,1.91 82.39,1.91 81.92,2.38 | 81.92,2.38 79.53,2.38 79.53,2.22 RGB7.3 79.38,2.06 77.79,2.06 RGB7.2 77.63,2.06 76.2,2.06 RGB7.1 | 81.92,2.38 D23.C
N$101
  Top 0.152: U7.5 83.66,36.99 84.3,37.62 85.57,38.89 85.57,39.37 85.57,39.85 85.72,40.01 86.88,40.01 87.63,39.26 87.63,37.52 U8.6
N$105
  Top 0.152: R8.1 88.9,28.89 87.63,30.16 87.63,34.77 85.72,36.67 85.72,36.83 U8.8 85.72,36.99 85.72,38.42 86.36,39.05 C8.1
N$107  (via drill 0.35)
  Top 0.152: v88.9,29.84 88.9,30.96 88.27,31.59 U8.3 | v90.96,20.95 90.96,6.35 90.81,6.19 RGB8.4
  Bottom 0.152: v88.9,29.84 93.03,25.72 93.03,22.86 | SV8.4 93.03,22.86 | v90.96,20.95 92.87,22.86 93.03,22.86
N$108
  Top 0.152: U8.1 85.57,31.59 85.25,31.27 85.25,23.5 84.93,23.18 84.93,14.92 83.98,13.97 83.98,8.1 85.09,6.99 87.31,6.99 87.31,6.19 RGB8.6 87.47,6.03 87.47,5.08 87.72,4.83 91.7,4.83 91.83,4.97 91.83,7.16 91.6,7.39 91.6,22.86 94.14,25.4 SV8.6
N$109
  Top 0.152: 86.84,15.72 86.84,12.54 90.01,9.37 90.01,7.3 89.06,6.35 89.06,6.19 RGB8.5 | 86.84,15.72 86.84,31.59 U8.2 | 86.84,15.72 90.17,19.05 90.17,26.67 94.61,26.67 95.41,25.88 95.41,24.13 96.68,22.86 SV8.3
N$112  (via drill 0.35)
  Top 0.152: v89.22,35.56 89.22,36.57 U8.5
  Bottom 0.152: U9.6 22.06,43.12 23.25,41.92 31.99,41.92 32.61,41.3 33.11,41.3 33.41,41.6 33.74,41.94 59.55,41.94 59.56,41.92 60.24,41.92 84.06,41.92 89.22,36.77 v89.22,35.56
  other vias: 11.43,43.12
N$116
  Top 0.152: RGB10.4 20.16,73.82 19.68,73.34 19.68,66.67 21.59,64.77 24.99,64.77 25.25,64.51 25.25,62.99 24.46,62.2 23.24,62.2 21.93,60.9 21.93,60.89 19.31,58.27 19.05,58.27 | 19.05,58.27 18.26,58.27 17.3,57.31 17.3,57.15 | 19.05,58.27 | 17.3,57.15 17.3,56.04 17.3,56.03 17.3,49.73 17.5,49.53 U10.3 | SV10.4 17.3,57.15
N$117
  Top 0.152: RGB10.6 23.5,73.98 23.5,74.93 23.25,75.17 19.52,75.17 19.38,75.03 19.38,73.39 13.2,67.21 13.2,65.11 16.18,62.13 SV10.6 16.18,58.73 15.06,57.61 15.06,54.15 16.76,52.46 16.76,47.64 17.4,46.99 18.86,46.99 19.3,47.42 19.3,47.58 U10.1
N$118
  Top 0.152: 18.73,57.15 SV10.3 | RGB10.5 21.59,73.66 21.59,72.39 20.32,71.12 20.32,66.67 21.92,65.08 25.11,65.08 25.55,64.64 25.55,62.87 24.59,61.9 23.37,61.9 22.24,60.77 22.24,60.76 18.73,57.26 18.73,57.15 | U10.2 18.77,49.34 17.61,50.5 17.61,55.91 17.61,56.03 18.73,57.15
N$119
  Top 0.152: C12.1 31.75,40.96 32.07,41.27 32.07,43.02 U12.8 32.17,45.35 33.81,46.99 33.81,52.13 35.88,54.19 R12.1
N$120
  Top 0.152: S1.3 11.27,13.34 11.27,15.24 10.79,15.72 D1.C 10.79,15.88 8.1,18.57 8.1,23.02 SV1.5
N$121  (via drill 0.35)
  Top 0.152: S2.3 23.65,13.34 23.65,15.24 24.13,15.72 D2.C 24.13,15.88 21.59,18.41 v21.59,22.54
  Bottom 0.152: v21.59,22.54 18.73,25.4 SV2.5
N$123
  Top 0.152: 48.42,25.88 50.16,25.88 D4.C | 48.42,25.88 48.42,13.34 S4.3 | SV4.5 45.22,25.88 48.42,25.88
N$124
  Top 0.152: D5.C 50.16,16.51 53.66,20 53.66,25.56 54.77,26.67 55.88,26.67 57.15,25.4 SV5.5 57.78,25.4 59.21,23.97 59.21,14.61 60.48,13.34 S5.3
N$125  (via drill 0.35)
  Top 0.152: v64.77,23.65 64.77,17.78 62.87,15.88 D6.C | S6.3 72.87,13.34 71.91,14.29 71.91,23.28 71.22,23.98 71.11,23.98 70.75,24.34 SV6.5
  Bottom 0.152: v64.77,23.65 67.79,26.67 69.37,26.67 70.64,25.4 SV6.5
N$126  (via drill 0.35)
  Top 0.152: v79.06,22.38 79.06,18.89 76.04,15.88 D7.C | v85.57,22.86 85.57,13.49 85.41,13.34 S7.3
  Bottom 0.152: v79.06,22.38 80.8,24.13 82.39,24.13 83.34,25.08 | 83.34,25.08 83.66,25.4 SV7.5 83.34,25.08 | 83.34,25.08 v85.57,22.86
N$127  (via drill 0.35)
  Top 0.152: v90.33,15.88 88.9,15.88 D8.C | S8.3 97.79,13.34 97.95,13.49 97.95,24.29 96.84,25.4 SV8.5
  Bottom 0.152: v90.33,15.88 95.89,15.88 97.95,17.94 97.95,24.22 SV8.5
N$128
  Top 0.152: C9.1 14.92,41.27 13.97,42.23 U9.8 13.97,43.81 13.34,44.45 13.34,49.85 11.43,51.75 R9.1
N$129
  Top 0.152: RGB2.3 23.18,2.06 21.59,2.06 RGB2.2 21.43,2.06 19.84,2.06 RGB2.1 19.59,1.49 15.61,1.49 D17.C 14.76,2.38 12.06,2.38 12.06,2.22 RGB1.3 11.91,2.06 10.32,2.06 RGB1.2 10.16,2.06 8.73,2.06 RGB1.1
N$130  (via drill 0.35)
  Top 0.152: D12.C 50.16,64.14 45.72,59.69 SV12.5 | v41.12,63.18 41.12,64.61 39.21,66.52 S12.3
  Bottom 0.152: v41.12,63.18 44.61,59.69 SV12.5
N$132  (via drill 0.35)
  Top 0.152: v9.37,60.64 9.37,62.71 10.79,64.14 D9.C | v2.38,58.42 1.91,58.9 1.91,66.36 2.06,66.52 S9.3
  Bottom 0.152: v9.37,60.64 8.41,59.69 SV9.5 5.24,59.69 3.97,58.42 v2.38,58.42
N$134  (via drill 0.35)
  Top 0.152: RGB12.4 42.7,73.82 43.34,73.18 43.34,62.87 43.32,62.84 43.32,58.27 SV12.4 | U12.3 29.63,49.53 27.94,51.22 v27.94,55.4
  Bottom 0.152: v27.94,55.4 28.4,55.4 29.03,56.03 33.58,56.03 34.04,56.49 34.54,56.49 34.84,56.19 41.23,56.19 SV12.4
N$136  (via drill 0.35)
  Top 0.152: U9.3 11.43,48.42 11.11,48.74 11.11,50.64 9.92,51.83 8.73,53.02 v8.73,58.42 8.73,73.66 8.89,73.82 RGB9.4
  Bottom 0.152: SV9.4 4.45,58.42 v8.73,58.42
N$137  (via drill 0.35)
  Top 0.152: U9.1 13.97,48.42 14.92,49.37 14.92,53.34 13.97,54.29 13.97,60.33 v14.92,61.28 14.92,62.95 12.89,64.98 12.89,67.34 15.88,70.32 15.88,71.75 14.61,73.03 12.38,73.03 12.38,73.82 RGB9.6
  Bottom 0.152: SV9.6 4.76,61.28 v14.92,61.28
N$138
  Top 0.152: RGB9.5 10.48,73.98 9.84,74.61 9.84,74.93 9.53,75.25 7.94,75.25 7.94,59.37 SV9.3 6.99,55.88 6.99,54.29 10.79,50.48 10.79,47.53 11.18,47.15 12.54,47.15 12.7,47.31 U9.2
N$139
  Top 0.152: RGB10.1 23.5,77.95 21.91,77.95 RGB10.2 21.75,77.95 20.32,77.95 RGB10.3 18.89,77.95 18.73,78.11 14.61,78.11 14.61,77.63 | 14.61,77.63 12.38,77.63 12.38,77.79 RGB9.1 12.22,77.95 10.64,77.95 RGB9.2 10.48,77.95 9.05,77.95 RGB9.3 | 14.61,77.63 D25.C
N$141  (via drill 0.35)
  Top 0.152: U9.5 10.16,44.09 v10.24,44.17 | v17.02,44.17 17.5,43.7 U10.6
  Bottom 0.152: v10.24,44.17 v17.02,44.17
N$145
  Top 0.152: C11.1 26.67,40.96 26.19,41.43 26.19,43.02 U11.8 26.11,45.01 24.13,46.99 24.13,49.04 25.71,50.62 25.71,53.88 R11.1
N$146
  Top 0.152: S11.3 26.99,66.52 26.99,64.43 SV11.5 36.22,64.18 D11.C
N$147  (via drill 0.35)
  Top 0.152: v23.5,49.69 23.5,48.42 U11.3 | RGB11.4 31.27,73.82 28.18,70.72 28.18,70.46 27.57,69.85 25.4,69.85 24.94,69.39 24.94,66.11 26.16,64.89 26.16,63.15 28.5,60.81 29.65,60.81 30.31,60.15 30.31,58.27 SV11.4 29.21,57.15 29.21,56.67 29.61,56.28 29.61,55.77 30.31,55.07 30.31,54.15 29.65,53.49 29.36,53.49 29.21,53.34 v29.21,50.81 v29.22,50.81
  Bottom 0.152: v29.22,50.81 28.89,50.48 26.58,50.48 26.33,50.73 25.83,50.73 24.8,49.69 v23.5,49.69
N$148
  Top 0.152: RGB11.6 34.77,73.98 33.97,74.77 33.97,75.09 33.81,75.25 27.53,75.25 24.13,71.85 22.43,71.85 22.23,71.64 22.23,66.04 22.3,65.97 22.3,65.96 22.62,65.63 24.99,65.63 25.86,64.76 25.86,63.02 SV11.6 27.94,59.69 26.67,58.42 26.67,52.32 27.28,51.72 27.3,51.69 27.3,50.01 27.15,49.85 26.67,49.85 26.11,49.28 26.11,48.42 U11.1
N$149
  Top 0.152: RGB11.5 33.11,73.75 28.91,69.55 26.36,69.55 25.53,68.71 25.53,65.96 26.47,65.02 26.47,64.42 30.61,60.28 30.61,59.23 30.63,59.21 30.63,58.26 SV11.3 31.73,56.71 30.61,55.59 30.61,54.02 30.16,53.57 30.16,47.42 30.03,47.29 29.21,47.29 29.21,47.32 29.11,47.42 29.11,49.32 28.89,49.53 27.15,49.53 26.83,49.21 26.83,47.47 26.51,47.15 24.92,47.15 24.84,47.24 U11.2
N$152  (via drill 0.35)
  Top 0.152: v22.86,44.45 22.86,43.66 22.38,43.18 U11.5 | v28.89,44.45 29.53,43.81 29.53,43.18 U12.6
  Bottom 0.152: v28.89,44.45 v22.86,44.45
N$155  (via drill 0.35)
  Top 0.152: v33.18,48.42 32.23,48.42 U12.1 | 41.75,59.37 42.07,59.69 SV12.6 41.75,59.37 | 41.75,59.37 40.96,58.58 40.96,51.4 v40.64,51.08 | 41.75,59.37 41.75,75.25 45.09,75.25 45.24,75.09 45.24,74.77 46.04,73.98 RGB12.6
  Bottom 0.152: v33.18,48.42 36.51,51.75 39.97,51.75 v40.64,51.08
N$156  (via drill 0.35)
  Top 0.152: RGB12.5 44.36,60.89 43.62,60.15 43.62,58.27 SV12.3 | U12.2 30.9,50.75 34.29,54.13 v34.29,55.88
  Bottom 0.152: v34.29,55.88 43.34,55.88 44.61,57.15 SV12.3
N$157
  Top 0.152: RGB12.1 46.04,77.95 44.45,77.95 RGB12.2 44.29,77.95 42.7,77.95 RGB12.3 42.55,77.95 41.12,77.95 40.96,78.11 36.83,78.11 36.83,77.63 | 36.83,77.63 34.92,77.63 34.92,77.79 RGB11.1 34.77,77.95 33.18,77.95 RGB11.2 33.02,77.95 31.43,77.95 RGB11.3 | 36.83,77.63 D27.C
N$159  (via drill 0.35)
  Top 0.152: v27.46,43.18 28.26,43.18 U12.5 | v69.22,43.18 U13.6
  Bottom 0.152: v69.22,43.18 68.42,43.97 62.61,43.97 62.48,43.84 59.34,43.84 58.8,44.38 58.04,44.38 57.5,43.84 54.36,43.84 54.07,44.13 29.43,44.13 29.14,43.84 28.13,43.84 v27.46,43.18
N$163  (via drill 0.35)
  Top 0.152: v64.45,52.39 62.87,52.39 R13.1 | v71.91,49.69 72.39,49.21 72.39,43.81 71.75,43.18 U13.8 C13.1
  Bottom 0.152: v64.45,52.39 67.15,49.69 v71.91,49.69
N$164
  Top 0.152: 58.9,60.17 58.42,59.69 SV13.5 | 58.9,60.17 62.87,64.14 D13.C | S13.3 51.59,66.52 53.66,64.45 53.66,57.12 54.74,56.03 58.21,56.03 58.86,56.69 58.86,58.39 58.9,58.42 58.9,60.17
N$165  (via drill 0.35)
  Top 0.152: v65.72,58.26 65.72,54.93 68.58,52.07 68.58,49.05 69.22,48.42 U13.3 | RGB13.4 53.98,73.82 53.98,58.26 55.09,57.15 SV13.4
  Bottom 0.152: SV13.4 53.98,57.15 53.98,60.17 54.77,60.96 58.06,60.96 58.86,60.15 58.86,59.25 59.85,58.26 v65.72,58.26
N$166  (via drill 0.35)
  Top 0.152: v67.15,55.88 68.58,55.88 69.37,55.09 69.37,53.82 71.12,52.07 71.12,49.05 71.75,48.42 U13.1 | RGB13.6 57.31,73.98 56.52,74.77 56.52,74.93 56.2,75.25 54.77,75.25 54.77,60.01 55.09,59.69 SV13.6
  Bottom 0.152: SV13.6 55.24,59.69 56.52,58.42 58.42,58.42 59.38,57.45 65.58,57.45 v67.15,55.88
N$167  (via drill 0.35)
  Top 0.152: v66.36,55.24 66.36,54.77 69.85,51.28 69.85,49.05 70.48,48.42 U13.2 | RGB13.5 55.72,73.82 56.52,73.03 56.52,58.26 57.63,57.15 SV13.3
  Bottom 0.152: v66.36,55.24 64.45,57.15 SV13.3
N$168
  Top 0.152: RGB14.1 68.42,77.95 66.99,77.95 RGB14.2 66.83,77.95 65.25,77.95 RGB14.3 65.09,77.95 63.98,77.95 63.82,78.11 59.69,78.11 59.69,77.63 | 59.69,77.63 57.47,77.63 57.47,77.79 RGB13.1 55.72,77.95 RGB13.2 55.56,77.95 53.98,77.95 RGB13.3 | 59.69,77.63 D29.C
N$170
  Top 0.152: U14.6 75.09,43.02 75.09,42.07 74.69,41.67 73.58,41.67 73.34,41.43 73.34,40.96 72.39,40.01 70.48,40.01 67.94,42.55 U13.5
N$174
  Top 0.152: C14.1 77.47,40.96 77.63,41.12 77.63,43.02 U14.8 77.79,43.18 78.26,43.66 78.26,49.48 76.32,51.42 76.32,52.72 77.05,53.44 R14.1
N$175  (via drill 0.35)
  Top 0.152: SV14.5 71.12,59.69 75.56,64.14 D14.C | v64.45,65.09 64.45,66.04 63.98,66.52 S14.3
  Bottom 0.152: v64.45,65.09 69.85,59.69 SV14.5
N$176  (via drill 0.35)
  Top 0.152: v73.66,57.78 73.66,51.28 75.12,49.81 75.12,48.35 U14.3 | RGB14.4 65.25,73.82 66.04,73.03 66.04,59.21 68.1,57.15 SV14.4
  Bottom 0.152: v73.66,57.78 73.03,58.42 69.53,58.42 68.26,57.15 SV14.4
N$177
  Top 0.152: 68.58,59.69 68.58,73.82 RGB14.6 | 68.58,59.69 SV14.6 | 68.58,59.69 68.66,59.61 68.66,59.29 69.38,58.57 71.27,58.57 74.22,61.52 76.28,61.52 76.52,61.28 76.62,61.17 76.62,59.88 74.32,57.59 74.32,57.16 74.32,57.15 74.32,51.3 75.67,49.95 75.67,47.04 75.88,46.83 77.47,46.83 77.68,47.04 U14.1
N$178  (via drill 0.35)
  Top 0.152: SV14.3 70.48,57.15 70.17,57.47 69.48,57.47 68.68,58.27 67.94,58.27 66.99,59.21 66.99,73.82 RGB14.5 | v74.93,57.15 74.62,56.84 74.62,51.42 76.41,49.63 U14.2
  Bottom 0.152: SV14.3 v74.93,57.15
N$181  (via drill 0.35)
  Top 0.152: v74.61,44.45 74.61,43.81 73.98,43.18 U14.5 | v80.49,44.45 80.96,43.97 80.96,43.18 U15.6
  Bottom 0.152: v80.49,44.45 v74.61,44.45
N$185
  Top 0.152: 83.66,42.07 83.66,43.02 U15.8 | 83.66,42.07 83.66,41.12 83.82,40.96 C15.1 | 83.66,42.07 80.17,42.07 80.19,42.09 79.4,42.09 79.27,42.23 79.27,44.62 80.54,45.89 80.54,51.06 79.53,52.07 R15.1
N$186  (via drill 0.35)
  Top 0.152: v87.95,63.18 88.9,64.14 D15.C | v79.06,63.82 76.36,66.52 S15.3
  Bottom 0.152: v87.95,63.18 84.45,59.69 SV15.5 83.19,59.69 v79.06,63.82
N$187
  Top 0.152: 81.12,57.15 80.01,56.04 80.01,53.66 81.07,52.6 U15.3 | 81.12,57.15 79.69,58.58 79.69,60.96 80.33,61.59 80.33,71.28 79.22,72.39 76.99,72.39 76.99,73.34 76.52,73.82 RGB15.4 | 81.12,57.15 SV15.4
N$188
  Top 0.152: RGB15.6 79.69,73.82 78.9,73.03 78.9,72.71 77.31,72.71 77.31,75.09 77.79,75.56 81.12,75.56 81.12,59.69 SV15.6 82.49,58.42 82.64,58.27 84.22,58.27 84.88,57.61 84.88,56.69 84.22,56.03 82.8,56.03 82.64,55.88 82.64,50.39 83.61,49.42 U15.1
N$189
  Top 0.152: RGB15.5 78.26,73.98 78.9,74.61 78.9,74.93 79.22,75.25 80.64,75.25 80.64,60.8 80.01,60.17 80.01,59.21 80.96,58.27 81.69,58.27 82.34,57.61 82.34,57.15 | U15.2 82.34,54.15 82.34,57.15 | SV15.3 82.34,57.15
N$190
  Top 0.152: RGB16.1 90.96,77.95 89.38,77.95 RGB16.2 89.22,77.95 87.79,77.95 RGB16.3 87.63,77.95 84.45,77.95 84.3,78.11 79.85,78.11 79.85,77.95 RGB15.1 79.69,77.95 78.26,77.95 RGB15.2 76.52,77.95 RGB15.3 76.36,77.95 76.36,78.11 73.34,78.11 73.18,77.95 73.18,77.63 71.12,77.63 D31.C
N$192
  Top 0.152: U15.5 79.85,43.18 79.85,44.67 80.23,45.06 80.74,45.06 81.34,44.45 85.82,44.45 87,43.27 U16.6
N$196
  Top 0.152: R16.1 88.9,50.48 89.22,50.8 90.17,50.8 90.17,49.54 90.37,49.34 90.37,47.3 90.17,47.1 90.17,43.81 89.53,43.18 U16.8 89.53,43.02 C16.1
N$197  (via drill 0.35)
  Top 0.152: 90.01,60.96 90.01,65.09 88.58,66.52 S16.3 | 90.01,60.96 90.01,59.69 88.9,58.58 D16.C | 90.01,60.96 v90.33,60.96
  Bottom 0.152: v90.33,60.96 95.41,60.96 96.68,59.69 SV16.5
N$198  (via drill 0.35)
  Top 0.152: U16.3 86.84,48.42 86.36,48.9 v86.36,57.15 86.36,63.5 83.98,65.88 83.98,71.75 86.04,73.82 87.63,73.82 RGB16.4
  Bottom 0.152: v86.36,57.15 SV16.4
N$199
  Top 0.152: U16.1 89.38,48.42 88.98,48.82 88.98,49.13 88.74,49.37 87.89,49.37 87.83,49.31 87.83,49.34 86.98,50.19 86.98,56.39 87.6,57 90.02,57 92.71,59.69 | SV16.6 94.14,59.69 92.71,59.69 | RGB16.6 92.71,72.29 92.71,59.69
N$200
  Top 0.152: RGB16.5 89.38,73.82 89.38,73.66 90.96,72.07 90.96,58.38 89.9,57.31 87.47,57.31 86.68,56.52 86.68,49.67 87,49.35 87.39,49.35 87.52,49.22 87.52,49.06 U16.2 89.01,47.58 89.01,47.42 89.14,47.29 89.93,47.29 90.06,47.42 90.06,49.22 89.93,49.35 89.19,49.35 88.69,49.86 88.25,49.86 88.12,49.99 88.12,52.88 88.25,53.01 88.8,53.01 93.11,57.33 93.11,57.61 93.77,58.27 94.69,58.27 95.81,57.15 SV16.3
N$203  (via drill 0.35)
  Top 0.152: v85.25,41.59 85.25,42.7 85.57,43.02 U16.5
  Bottom 0.152: v85.25,41.59 91.92,34.92 94.77,34.92 | 94.77,34.92 95.89,34.92 96.77,35.81 OUTP.1 | END.2 94.8,34.9 94.77,34.92
RESET  (via drill 0.35)
  Top 0.152: IC1.15 36.2,48.1 35.56,47.47 35.56,46.99 35.43,46.99 35.35,46.91 34.21,46.91 32.86,45.56 v32.86,41.91 | IC3.15 57.78,48.1 58.42,47.47 v58.42,43.47
  Bottom 0.152: INP.6 4.45,42.55 6.99,42.55 9.22,44.78 20.83,44.78 23.38,42.23 32.54,42.23 v32.86,41.91 33.19,42.24 58.42,42.24 | OUTP.6 94.14,41.27 93.19,42.23 59.69,42.23 59.68,42.24 58.42,42.24 | v58.42,43.47 58.42,42.24
RETURN
  Bottom 0.152: END.1 96.68,33.02 97.95,34.29 97.95,37.47 95.57,37.47 94.3,36.2 OUTP.2 95.65,37.62 95.65,39.2 96.31,39.85 96.93,39.85 97.89,40.81 97.89,41.74 97.23,42.39 96.31,42.39 96.3,42.39 96.04,42.39 95.65,42.78 95.65,44.28 95.73,44.35 95.73,45.45 96.25,45.97 96.25,47.83 95.67,48.41 94.49,48.41 93.38,47.3 74.33,47.3 73.72,47.9 72.97,47.9 72.36,47.3 58.16,47.3 56.92,48.54 54.85,48.54 53.32,47.01 51.32,47.01 51.05,47.28 47.09,47.28 42,52.36 36.26,52.36 35.62,51.72 28.84,51.72 28.23,51.1 26.82,51.1 26.59,51.33 25.58,51.33 25.35,51.1 14.52,51.1 14.22,51.41 13.72,51.41 13.36,51.05 13.36,50.19 8.89,45.72 3.5,45.72 2.06,44.28 2.06,42.17 1.75,41.86 1.75,37.97 3.17,36.55 INP.2

## Text on the board
Top: Top
Bottom: Push Button-RGB w. Test RGB a. Switch | Bot
tNames: green | Push Button-RGB w. Test-RGB a. Switch Vers. 1.0 by Hardi und Jürgen (fromue)
bNames: INPUT | OUTPUT | Push Button-RGB w. Test-RGB a. Switch | by Hardi und Jürgen (fromue) | Vers. 1.0